# Altium schematic sheet 主控模块.SchDoc
size A4; DocumentNumber: 3; SheetNumber: 3; SheetTotal: 8
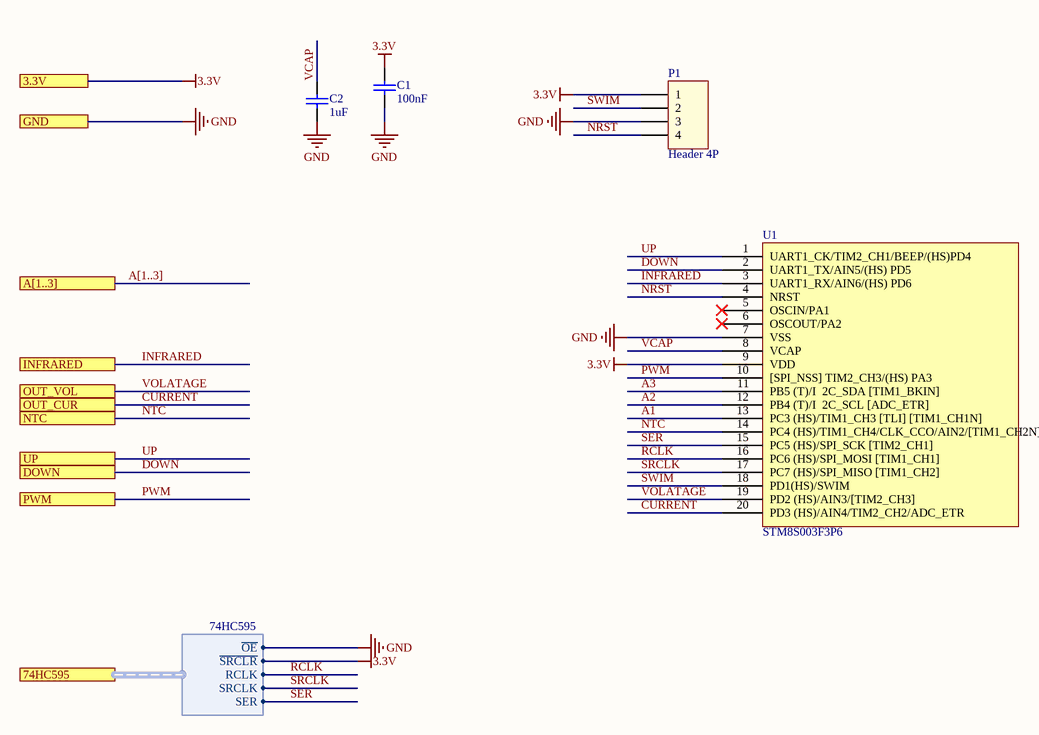
[diagram p0: 主控模块.SchDoc]

## Parts
C1  100nF  [LC-0603_C]
C2  1uF  [LC-0603_C]
P1  Header 4P  [2.54mm_4P]
U1  STM8S003F3P6  [LC-TSSOP-20]

## Ports
3.3V, 74HC595 (harness 74HC595), A[1..3], DOWN, GND, INFRARED, NTC, OUT_CUR, OUT_VOL, PWM, UP

## Harnesses
74HC595: ~{OE}, RCLK, ~{SRCLR}, SRCLK, SER

## Nets
3.3V: C1.2 P1.1 U1.9(VDD) ; port 3.3V, port 74HC595.~{SRCLR}
GND: C1.1 C2.1 P1.3 U1.7(VSS) ; port GND, port 74HC595.~{OE}
A1: U1.13(PC3_(HS)/TIM1_CH3_[TLI]_[TIM1_CH1N])
A2: U1.12(PB4_(T)/I__2C_SCL_[ADC_ETR])
A3: U1.11(PB5_(T)/I__2C_SDA_[TIM1_BKIN])
CURRENT: U1.20(PD3_(HS)/AIN4/TIM2_CH2/ADC_ETR) ; port OUT_CUR
DOWN: U1.2(UART1_TX/AIN5/(HS)_PD5) ; port DOWN
INFRARED: U1.3(UART1_RX/AIN6/(HS)_PD6) ; port INFRARED
NRST: P1.4 U1.4(NRST)
NTC: U1.14(PC4_(HS)/TIM1_CH4/CLK_CCO/AIN2/[TIM1_CH2N]) ; port NTC
PWM: U1.10([SPI_NSS]_TIM2_CH3/(HS)_PA3) ; port PWM
RCLK: U1.16(PC6_(HS)/SPI_MOSI_[TIM1_CH1]) ; port 74HC595.RCLK
SER: U1.15(PC5_(HS)/SPI_SCK_[TIM2_CH1]) ; port 74HC595.SER
SRCLK: U1.17(PC7_(HS)/SPI_MISO_[TIM1_CH2]) ; port 74HC595.SRCLK
SWIM: P1.2 U1.18(PD1(HS)/SWIM)
UP: U1.1(UART1_CK/TIM2_CH1/BEEP/(HS)PD4) ; port UP
VCAP: C2.2 U1.8(VCAP)
VOLATAGE: U1.19(PD2_(HS)/AIN3/[TIM2_CH3]) ; port OUT_VOL

Not connected (* = marked no-connect by the designer): U1 5(OSCIN/PA1)* 6(OSCOUT/PA2)*

## Buses and harness runs
bus A[1..3] = port A[1..3]

## Library data of the parts
C1 = 0603 100nF (104) 10% 50V: 贴片电容; ComponentLink1Description: 供应商链接; ComponentLink1URL: http://www.szlcsc.com/product/details_15331.html; Package: 0603; Supplier: LC; SuppliersPartNumber: C14663
C2 = 0603 1uF (105) 10% 50V: 贴片电容; ComponentLink1Description: 供应商链接; ComponentLink1URL: http://www.szlcsc.com/product/details_16531.html; Package: 0603; Supplier: LC; SuppliersPartNumber: C15849
U1 = STM8S003F3P6: MCU; ComponentLink1Description: 供应商链接; ComponentLink1URL: http://www.szlcsc.com/product/details_19317.html; Package: TSSOP-20; Supplier: LC; SuppliersPartNumber: C18615